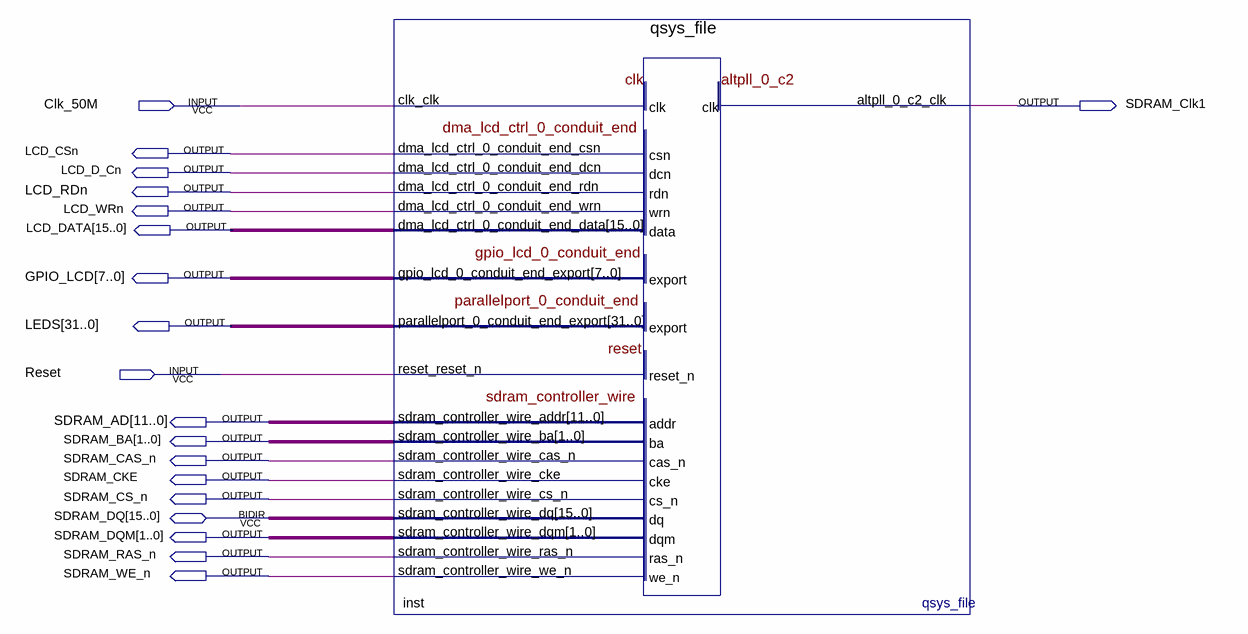
[diagram p0: schematic sheet]
// Quartus schematic Labo01.bdf as structural Verilog: 1 symbols, 19 pins
module Labo01 (
  input  Clk_50M,
  input  Reset,
  inout  [15:0] SDRAM_DQ,
  output SDRAM_Clk1,
  output LCD_CSn,
  output LCD_D_Cn,
  output LCD_RDn,
  output LCD_WRn,
  output [15:0] LCD_DATA,
  output [7:0] GPIO_LCD,
  output [31:0] LEDS,
  output [11:0] SDRAM_AD,
  output [1:0] SDRAM_BA,
  output SDRAM_CAS_n,
  output SDRAM_CKE,
  output SDRAM_CS_n,
  output [1:0] SDRAM_DQM,
  output SDRAM_RAS_n,
  output SDRAM_WE_n
);

  qsys_file inst (
    .clk_clk(Clk_50M), .reset_reset_n(Reset), .altpll_0_c2_clk(SDRAM_Clk1),
    .dma_lcd_ctrl_0_conduit_end_csn(LCD_CSn), .dma_lcd_ctrl_0_conduit_end_dcn(LCD_D_Cn),
    .dma_lcd_ctrl_0_conduit_end_rdn(LCD_RDn), .dma_lcd_ctrl_0_conduit_end_wrn(LCD_WRn),
    .dma_lcd_ctrl_0_conduit_end_data(LCD_DATA), .sdram_controller_wire_addr(SDRAM_AD),
    .sdram_controller_wire_ba(SDRAM_BA), .sdram_controller_wire_cas_n(SDRAM_CAS_n),
    .sdram_controller_wire_cke(SDRAM_CKE), .sdram_controller_wire_cs_n(SDRAM_CS_n),
    .sdram_controller_wire_dqm(SDRAM_DQM), .sdram_controller_wire_ras_n(SDRAM_RAS_n),
    .sdram_controller_wire_we_n(SDRAM_WE_n), .gpio_lcd_0_conduit_end_export(GPIO_LCD),
    .parallelport_0_conduit_end_export(LEDS), .sdram_controller_wire_dq(SDRAM_DQ));
endmodule
